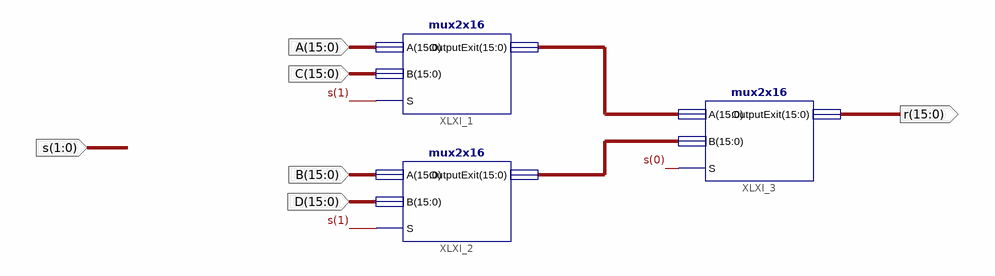
[diagram p0: schematic sheet 1]
// Xilinx ISE schematic mux4x16.sch (spartan3e) as structural Verilog: 3 symbols, 6 ports
module mux4x16 (
  input  [15:0] A,
  input  [15:0] C,
  input  [15:0] B,
  input  [15:0] D,
  input  [1:0] s,
  output [15:0] r
);

  wire [15:0] XLXN_1, XLXN_2;

  mux2x16 XLXI_1 (.A(A), .B(C), .S(s[1]), .OutputExit(XLXN_1));
  mux2x16 XLXI_2 (.A(B), .B(D), .S(s[1]), .OutputExit(XLXN_2));
  mux2x16 XLXI_3 (.A(XLXN_1), .B(XLXN_2), .S(s[0]), .OutputExit(r));
endmodule
